# Altium schematic sheet ethernet_W5500.SchDoc
size A4; SheetNumber: 5; SheetTotal: 5
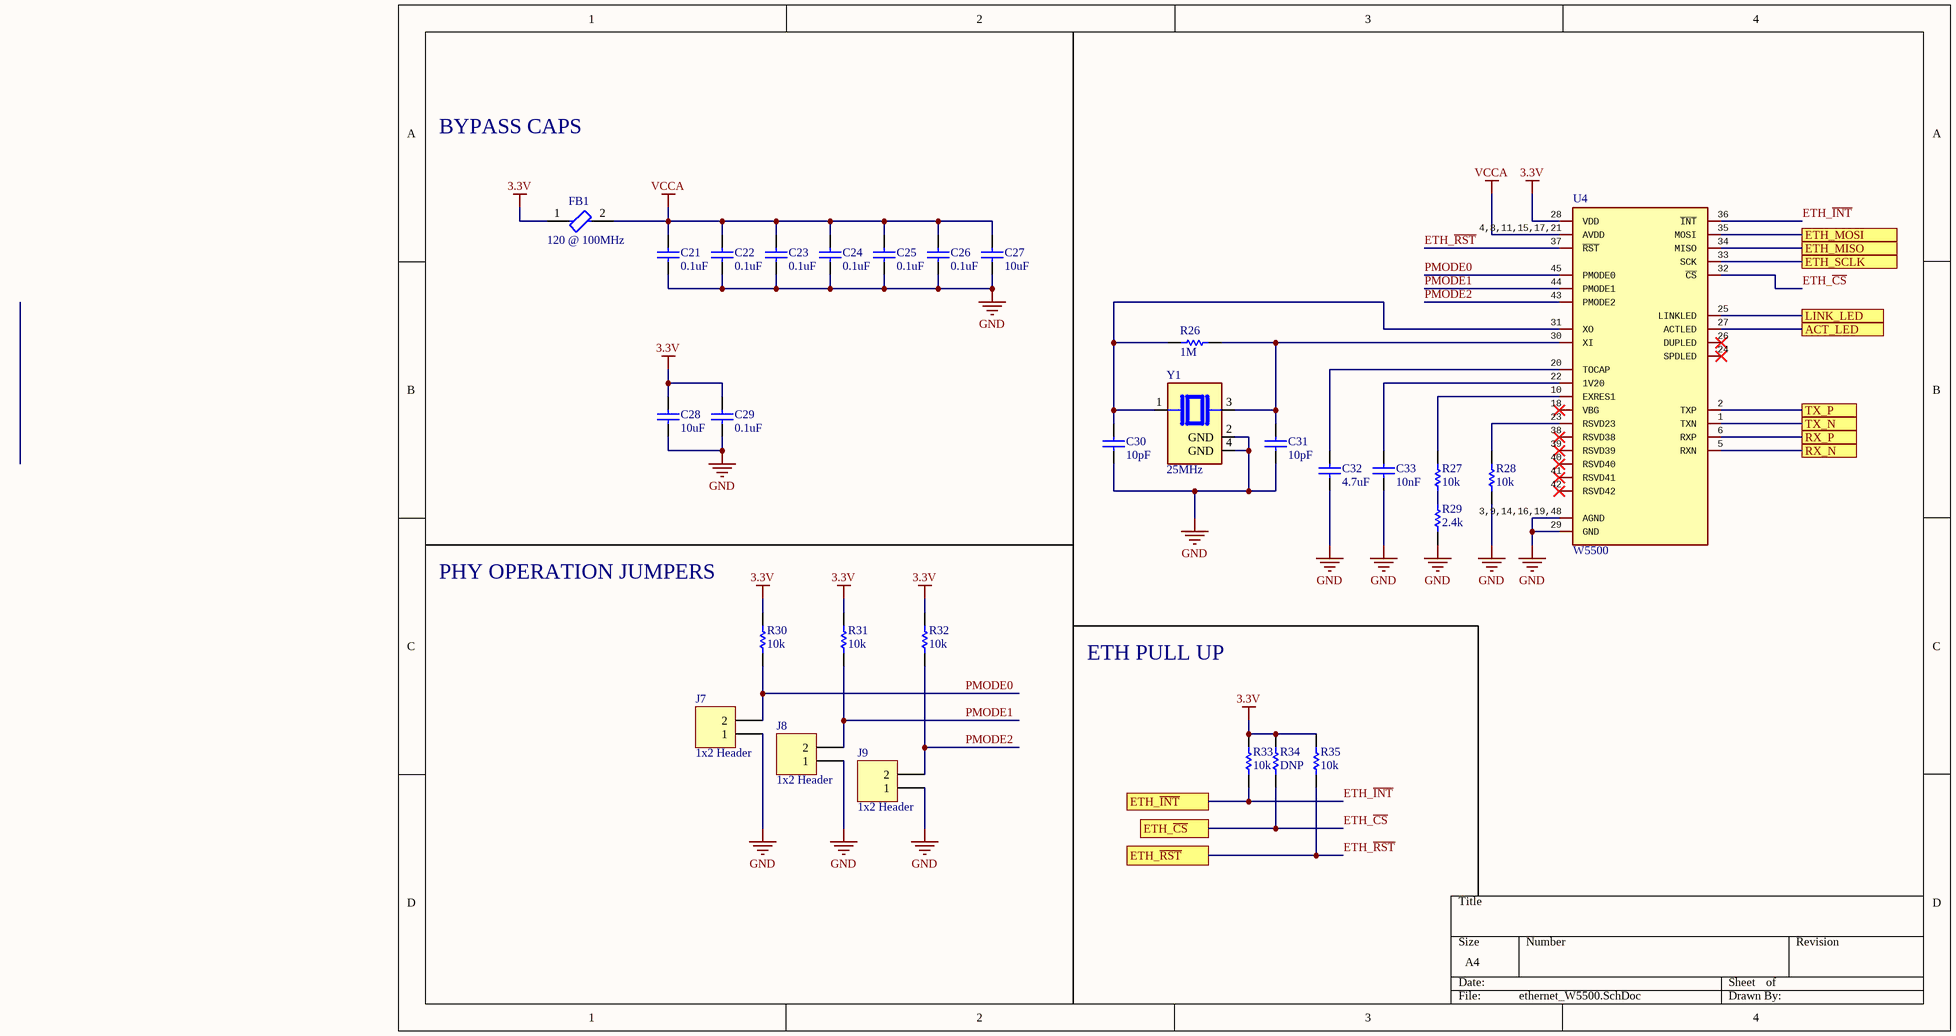
[diagram p0: ethernet_W5500.SchDoc]

## Parts
C21  value 0.1uF  [0603 - Capacitor]  (hidden comment: Capacitor - Nonpolarized)
C22  value 0.1uF  [0603 - Capacitor]  (hidden comment: Capacitor - Nonpolarized)
C23  value 0.1uF  [0603 - Capacitor]  (hidden comment: Capacitor - Nonpolarized)
C24  value 0.1uF  [0603 - Capacitor]  (hidden comment: Capacitor - Nonpolarized)
C25  value 0.1uF  [0603 - Capacitor]  (hidden comment: Capacitor - Nonpolarized)
C26  value 0.1uF  [0603 - Capacitor]  (hidden comment: Capacitor - Nonpolarized)
C27  value 10uF  [0603 - Capacitor]  (hidden comment: Capacitor - Nonpolarized)
C28  value 10uF  [0603 - Capacitor]  (hidden comment: Capacitor - Nonpolarized)
C29  value 0.1uF  [0603 - Capacitor]  (hidden comment: Capacitor - Nonpolarized)
C30  value 10pF  [0603 - Capacitor]  (hidden comment: Capacitor - Nonpolarized)
C31  value 10pF  [0603 - Capacitor]  (hidden comment: Capacitor - Nonpolarized)
C32  value 4.7uF  [0603 - Capacitor]  (hidden comment: Capacitor - Nonpolarized)
C33  value 10nF  [0603 - Capacitor]  (hidden comment: Capacitor - Nonpolarized)
FB1  120 @ 100MHz  [FP-BLM21-0_2-t0_85-e0_5-MFG]
J7  1x2 Header  [HDR1X2]
J8  1x2 Header  [HDR1X2]
J9  1x2 Header  [HDR1X2]
R26  value 1M  [0603 - Resistor]  (hidden comment: Resistor)
R27  value 10k  [0603 - Resistor]  (hidden comment: Resistor)
R28  value 10k  [0603 - Resistor]  (hidden comment: Resistor)
R29  value 2.4k  [0603 - Resistor]  (hidden comment: Resistor)
R30  value 10k  [0603 - Resistor]  (hidden comment: Resistor)
R31  value 10k  [0603 - Resistor]  (hidden comment: Resistor)
R32  value 10k  [0603 - Resistor]  (hidden comment: Resistor)
R33  value 10k  [0603 - Resistor]  (hidden comment: Resistor)
R34  value DNP  [0603 - Resistor]  (hidden comment: Resistor)
R35  value 10k  [0603 - Resistor]  (hidden comment: Resistor)
U4  W5500  [W5500]
Y1  25MHz  [XTAL_TSX-3225_25.0000MF20P-C0]

## Ports
ACT_LED (see main[2B], ethernet_RJ45[2C]), ETH_MISO (see main[3B], uwb_module[4C]), ETH_MOSI (see main[3B], uwb_module[4B]), ETH_SCLK (see main[3B], uwb_module[4C]), ETH_~{CS} (see main[3B], uwb_module[4B]), ETH_~{INT} (see main[3B], uwb_module[2C]), ETH_~{RST} (see main[3B], uwb_module[2C]), LINK_LED (see main[2B], ethernet_RJ45[2C]), RX_N (see main[2B], ethernet_RJ45[4C]), RX_P (see main[2B], ethernet_RJ45[4C]), TX_N (see main[2B], ethernet_RJ45[4B]), TX_P (see main[2B], ethernet_RJ45[4B])

## Nets
3.3V: C28.2 C29.2 FB1.1 R30.2 R31.2 R32.2 R33.2 R34.2 R35.2 U4.28(VDD)
GND: C21.1 C22.1 C23.1 C24.1 C25.1 C26.1 C27.1 C28.1 C29.1 C30.1 C31.1 C32.1 C33.1 J7.1 J8.1 J9.1 R28.1 R29.1 U4.3,9,14,16,19,48(AGND) U4.29(GND) Y1.2(GND) Y1.4(GND)
VCCA: C21.2 C22.2 C23.2 C24.2 C25.2 C26.2 C27.2 FB1.2 U4.4,8,11,15,17,21(AVDD)
ACT_LED: U4.27(ACTLED) ; port ACT_LED
ETH_~{CS}: R34.1 U4.32(~{CS}) ; port ETH_~{CS}
ETH_~{INT}: R33.1 U4.36(~{INT}) ; port ETH_~{INT}
ETH_MISO: U4.34(MISO) ; port ETH_MISO
ETH_MOSI: U4.35(MOSI) ; port ETH_MOSI
ETH_~{RST}: R35.1 U4.37(~{RST}) ; port ETH_~{RST}
ETH_SCLK: U4.33(SCK) ; port ETH_SCLK
LINK_LED: U4.25(LINKLED) ; port LINK_LED
PMODE0: J7.2 R30.1 U4.45(PMODE0)
PMODE1: J8.2 R31.1 U4.44(PMODE1)
PMODE2: J9.2 R32.1 U4.43(PMODE2)
RX_N: U4.5(RXN) ; port RX_N
RX_P: U4.6(RXP) ; port RX_P
TX_N: U4.1(TXN) ; port TX_N
TX_P: U4.2(TXP) ; port TX_P
NetC30_2: C30.2 R26.2 U4.31(XO) Y1.1
NetC31_2: C31.2 R26.1 U4.30(XI) Y1.3
NetC32_2: C32.2 U4.20(TOCAP)
NetC33_2: C33.2 U4.22(1V20)
NetR27_1: R27.1 R29.2
NetR27_2: R27.2 U4.10(EXRES1)
NetR28_2: R28.2 U4.23(RSVD23)

Not connected (* = marked no-connect by the designer): U4 18(VBG)* 24(SPDLED)* 26(DUPLED)* 38(RSVD38)* 39(RSVD39)* 40(RSVD40)* 41(RSVD41)* 42(RSVD42)*

## Notes on the sheet
- BYPASS CAPS
- PHY OPERATION JUMPERS
- ETH PULL UP

## Library data of the parts
C21-C29 = Capacitor - Nonpolarized: Nonpolarized Capacitor; Manufacturer: YAGEO; Manufacturer Part Number: CC0603KRX7R9BB104; Rating: 50V X7R +/-10%; Supplier Part Number: C14663; Supplier: JLCPCB; Link: https://jlcpcb.com/partdetail/Yageo-CC0603KRX7R9BB104/C14663
C30 C31 = Capacitor - Nonpolarized: Nonpolarized Capacitor; Manufacturer: Samsung Electro-Mechanics; Manufacturer Part Number: CL10C100JB8NNNC; Rating: 50V C0G +/-5%; Supplier Part Number: C1634; Supplier: JLCPCB; Link: https://jlcpcb.com/partdetail/1986-CL10C100JB8NNNC/C1634
C32 = Capacitor - Nonpolarized: Nonpolarized Capacitor; Manufacturer: Samsung Electro-Mechanics; Manufacturer Part Number: CL10A475KO8NNNC; Rating: 16V X5R +/-10%; Supplier Part Number: C19666; Supplier: JLCPCB; Link: https://jlcpcb.com/partdetail/20375-CL10A475KO8NNNC/C19666
C33 = Capacitor - Nonpolarized: Nonpolarized Capacitor; Manufacturer: FH (Guangdong Fenghua Advanced Tech); Manufacturer Part Number: 0603B103K500NT; Rating: 50V X7R +/-10%; Supplier Part Number: C57112; Supplier: JLCPCB; Link: https://jlcpcb.com/partdetail/58143-0603B103K500NT/C57112
FB1 = CMP-06046-002573-1: Chip Ferrite Bead, 0805, 120Ω @ 100MHz, 0.09Ω, 25%, 1A; Manufacturer: Murata Electronics; Manufacturer Part Number: BLM21AG121SH1D; Supplier: Mouser; Link: https://www.mouser.ca/ProductDetail/Murata-Electronics/BLM21AG121SH1D?qs=RTwwdbUDBXC774LJBjqxGQ%3D%3D; Supplier Part Number: 81-BLM21AG121SH1D
J7-J9 = 1x2 Header: 1x2 Pin Header
R26 = Resistor: Manufacturer Part Number: 0603WAF1004T5E; Manufacturer: UNI-ROYAL(Uniroyal Elec); Rating: 100mW; Supplier Part Number: C22935; Supplier: JLCPCB; Link: https://jlcpcb.com/partdetail/23662-0603WAF1004T5E/C22935
R27 R28 R30-R33 R35 = Resistor: Manufacturer Part Number: 0603WAF1002T5E; Manufacturer: UNI-ROYAL(Uniroyal Elec); Rating: 100mW; Supplier Part Number: C25804; Supplier: JLCPCB; Link: https://jlcpcb.com/partdetail/26547-0603WAF1002T5E/C25804
R29 = Resistor: Manufacturer Part Number: 0603WAF2401T5E; Manufacturer: UNI-ROYAL(Uniroyal Elec); Rating: 100mW; Supplier Part Number: C22940; Supplier: JLCPCB; Link: https://jlcpcb.com/partdetail/23667-0603WAF2401T5E/C22940
U4 = W5500: pin to pad: 3,9,14,16,19,48>3+9+14+16+19+48 4,8,11,15,17,21>4+8+11+15+17+21; Manufacturer: WIZNET; Link: https://jlcpcb.com/partdetail/Wiznet-W5500/C32843; Manufacturer Part Number: W5500; Supplier: JLCPCB; Supplier Part Number: C32843
Y1 = TSX-3225_25.0000MF20P-C0: 25 MHz Â±10ppm Crystal 18pF 40 Ohms 4-SMD, No Lead; Manufacturer Part Number: X322525MOB4SI; Manufacturer: Yangxing Tech; Supplier Part Number: C9006; Supplier: JLCPCB; Link: https://jlcpcb.com/partdetail/YangxingTech-X322525MOB4SI/C9006; Value: 25MHz
R34 = Resistor: Rating: *; Manufacturer Part Number: *; Manufacturer: *; Supplier Part Number: *; Supplier: *